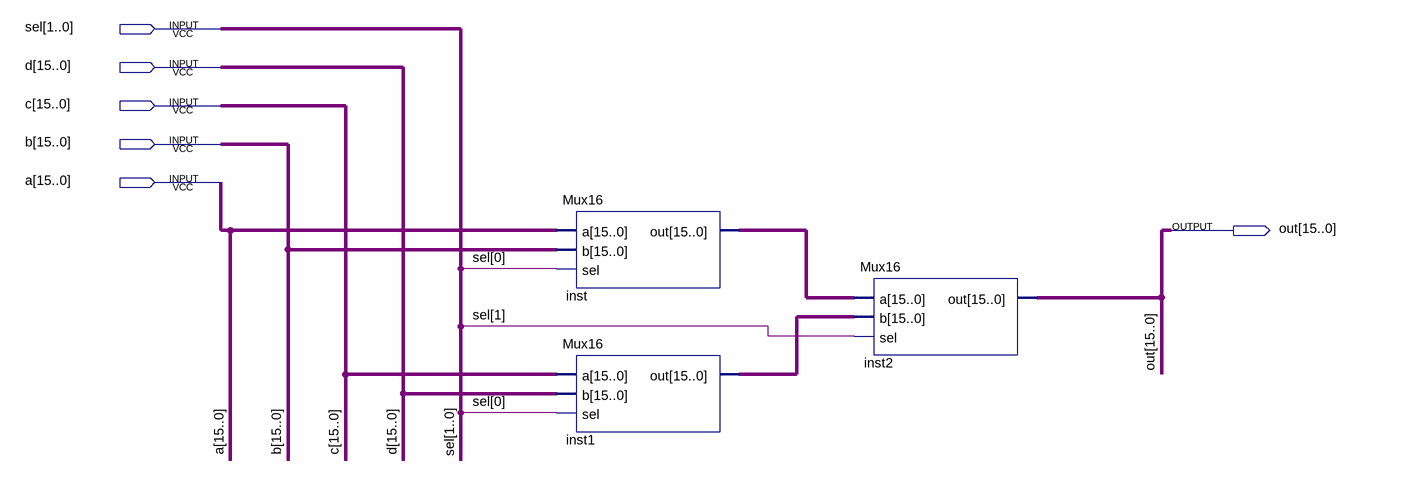
[diagram p0: schematic sheet]
// Quartus schematic Mux4Way16.bdf as structural Verilog: 3 symbols, 6 pins
module Mux4Way16 (
  input  [1:0] sel,
  input  [15:0] d,
  input  [15:0] c,
  input  [15:0] b,
  input  [15:0] a,
  output [15:0] out
);

  wire [15:0] inst1_out, inst_out;

  Mux16 inst (.a(a), .b(b), .sel(sel[0]), .out(inst_out));
  Mux16 inst1 (.a(c), .b(d), .sel(sel[0]), .out(inst1_out));
  Mux16 inst2 (.a(inst_out), .b(inst1_out), .sel(sel[1]), .out(out));
endmodule
